# Altium schematic sheet ALLPRINT-CAPBOARD-677512-MCU.SchDoc
size A3; Organization: Altium Limited; Address1: 3 Minna Close; Address2: Belrose; Address3: NSW 2085; Address4: Australia; DocumentNumber: 3; SheetNumber: 2; SheetTotal: 11
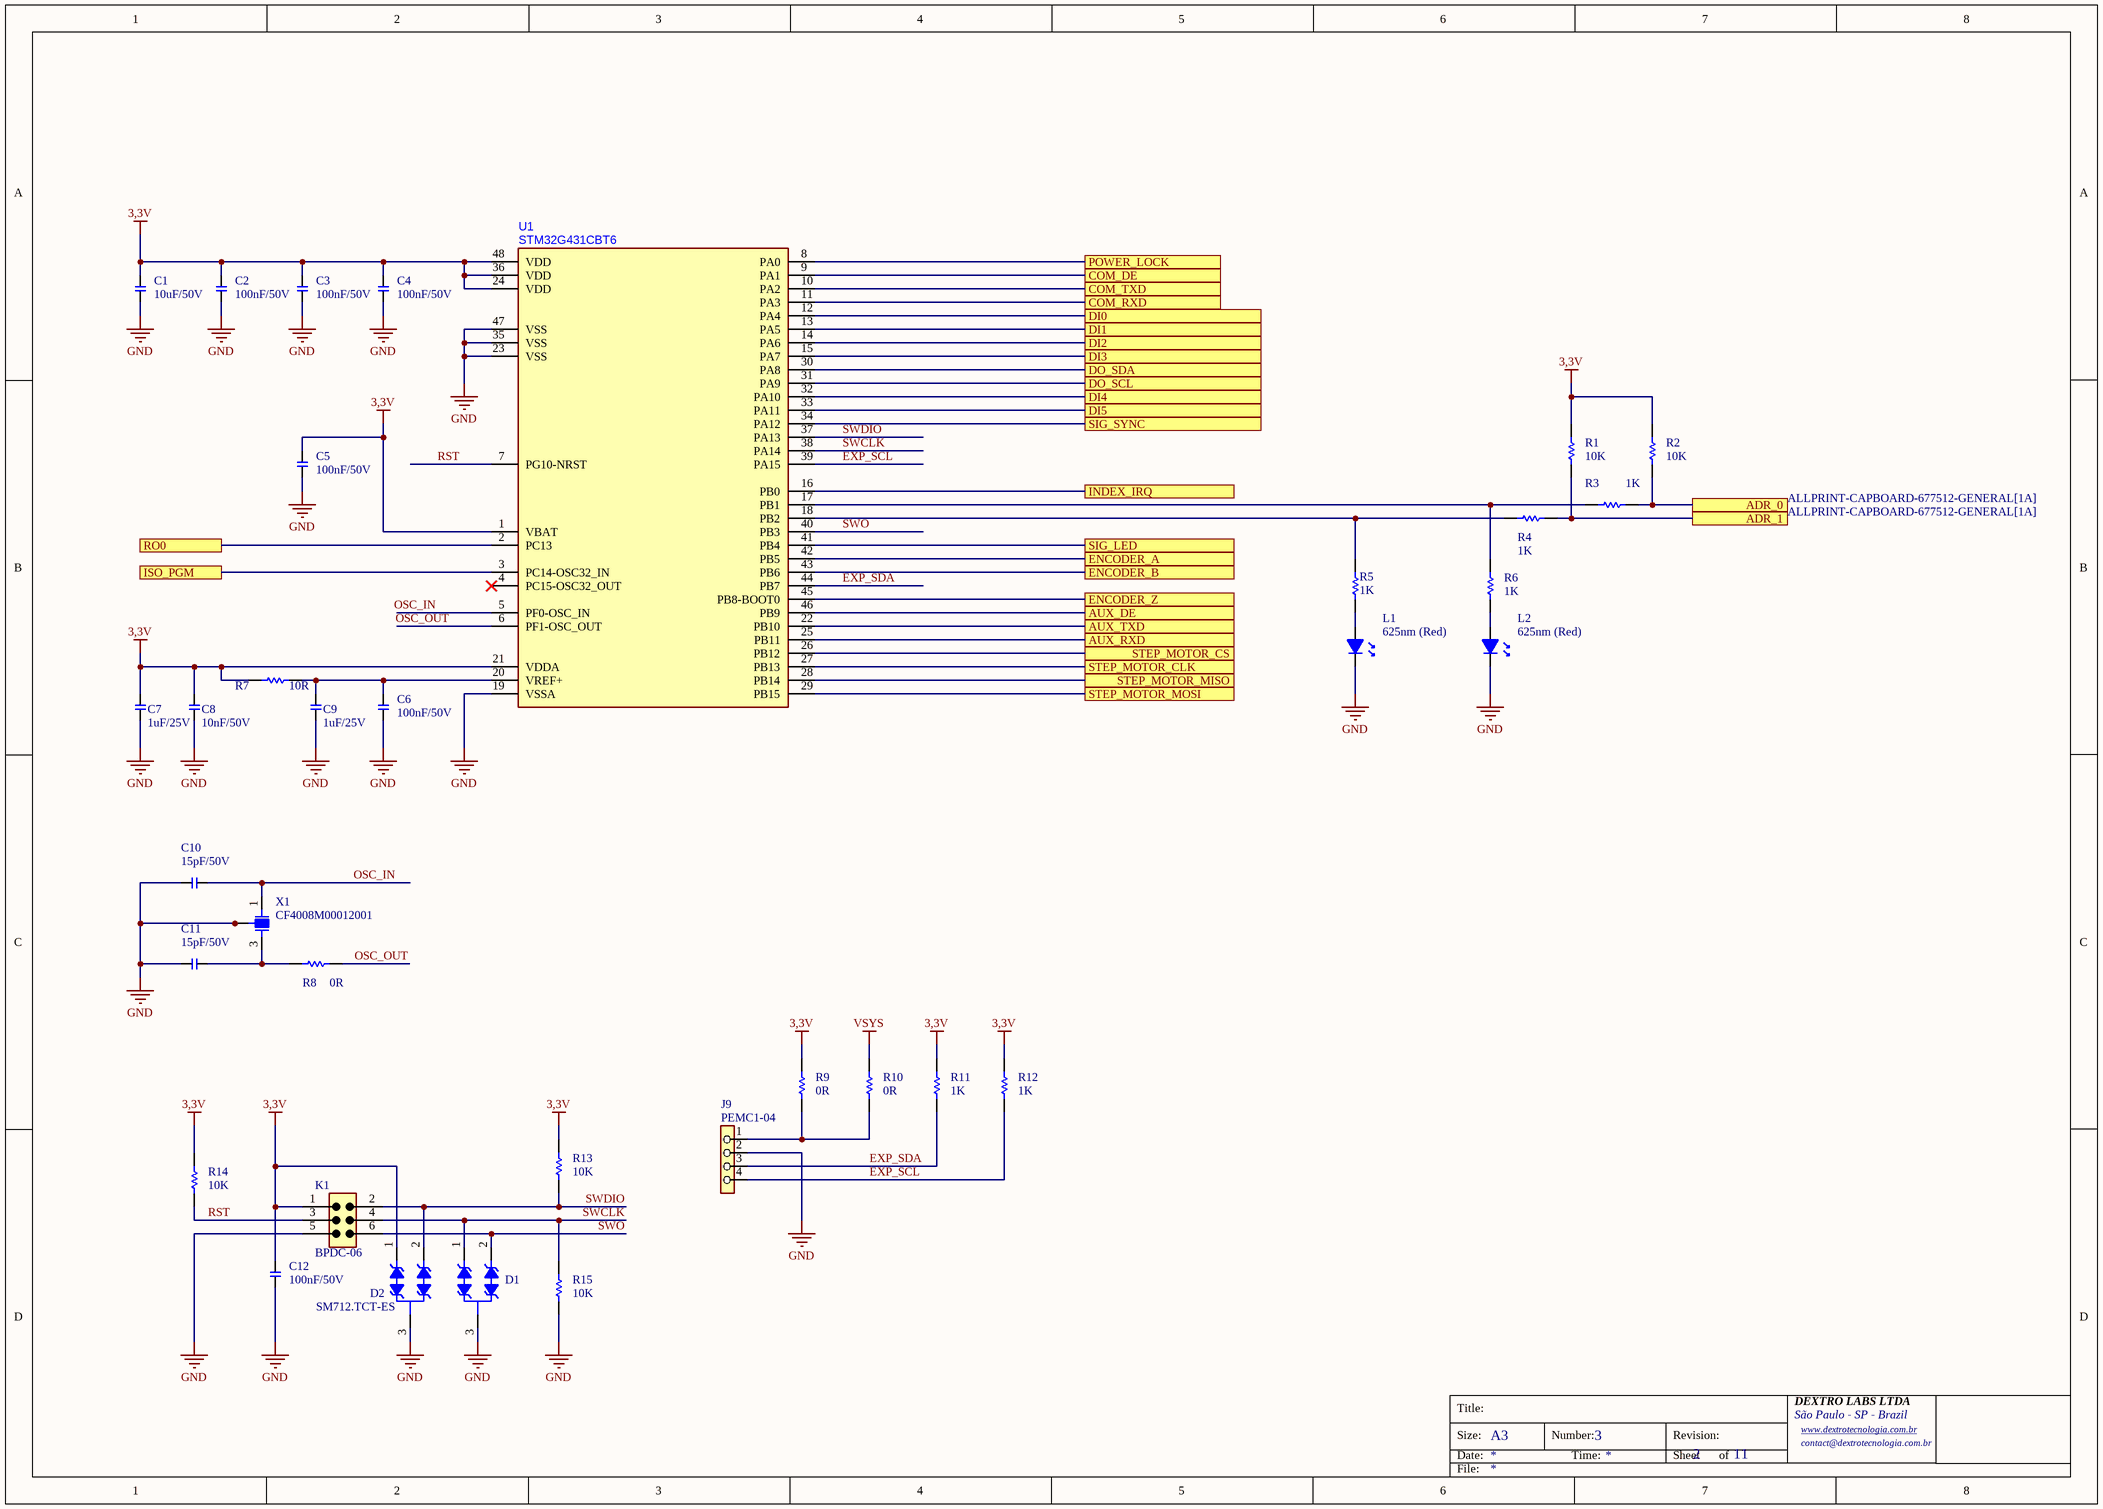
[diagram p0: ALLPRINT-CAPBOARD-677512-MCU.SchDoc]

## Parts
C1  10uF/50V  [CAP-0805]
C2  100nF/50V  [CAP-0603]
C3  100nF/50V  [CAP-0603]
C4  100nF/50V  [CAP-0603]
C5  100nF/50V  [CAP-0603]
C6  100nF/50V  [CAP-0603]
C7  1uF/25V  [CAP-0603]
C8  10nF/50V  [CAP-0603]
C9  1uF/25V  [CAP-0603]
C10  15pF/50V  [CAP-0603]
C11  15pF/50V  [CAP-0603]
C12  100nF/50V  [CAP-0603]
D1  SM712.TCT-ES  [SOT23-3]  (value not drawn)
D2  SM712.TCT-ES  [SOT23-3]
J9  PEMC1-04  [PEMC1-04]
K1  BPDC-06  [BPDC-06]
L1  Wavelength: 625nm (Red)  [LED-SMD-0603]  (hidden comment: YLED0603R)
L2  Wavelength: 625nm (Red)  [LED-SMD-0603]  (hidden comment: YLED0603R)
R1  10K  [RES-0603]
R2  10K  [RES-0603]
R3  1K  [RES-0603]
R4  1K  [RES-0603]
R5  1K  [RES-0603]
R6  1K  [RES-0603]
R7  10R  [RES-0603]
R8  0R  [RES-0603]
R9  0R  [RES-0805]
R10  0R  [RES-0805]
R11  1K  [RES-0603]
R12  1K  [RES-0603]
R13  10K  [RES-0603]
R14  10K  [RES-0603]
R15  10K  [RES-0603]
U1  STM32G431CBT6  [LQFP-48_L7.0-W7.0-P0.50-LS9.0-BL]
X1  CF4008M00012001  [TAXM8M4RDBCCT2T]

## Ports
ADR_0 (see ALLPRINT-CAPBOARD-677512-GENERAL[1A]), ADR_1 (see ALLPRINT-CAPBOARD-677512-GENERAL[1A]), AUX_DE (see ALLPRINT-CAPBOARD-677512-GENERAL[2B], ALLPRINT-CAPBOARD-677512-HEAD-BOARD-COMM[3C]), AUX_RXD (see ALLPRINT-CAPBOARD-677512-GENERAL[2B], ALLPRINT-CAPBOARD-677512-HEAD-BOARD-COMM[3C]), AUX_TXD (see ALLPRINT-CAPBOARD-677512-GENERAL[2B], ALLPRINT-CAPBOARD-677512-HEAD-BOARD-COMM[3C]), COM_DE (see ALLPRINT-CAPBOARD-677512-GENERAL[2B], ALLPRINT-CAPBOARD-677512-HEAD-BOARD-COMM[3B]), COM_RXD (see ALLPRINT-CAPBOARD-677512-GENERAL[2B], ALLPRINT-CAPBOARD-677512-HEAD-BOARD-COMM[3B]), COM_TXD (see ALLPRINT-CAPBOARD-677512-GENERAL[2B], ALLPRINT-CAPBOARD-677512-HEAD-BOARD-COMM[3B]), DI0 (see ALLPRINT-CAPBOARD-677512-GENERAL[2B], ALLPRINT-CAPBOARD-677512-SIGNAL-INPUTS[6A]), DI1 (see ALLPRINT-CAPBOARD-677512-GENERAL[2B], ALLPRINT-CAPBOARD-677512-SIGNAL-INPUTS[6B]), DI2 (see ALLPRINT-CAPBOARD-677512-GENERAL[2B], ALLPRINT-CAPBOARD-677512-SIGNAL-INPUTS[6B]), DI3 (see ALLPRINT-CAPBOARD-677512-GENERAL[2B], ALLPRINT-CAPBOARD-677512-SIGNAL-INPUTS[6C]), DI4 (see ALLPRINT-CAPBOARD-677512-GENERAL[2B], ALLPRINT-CAPBOARD-677512-SIGNAL-INPUTS[6C]), DI5 (see ALLPRINT-CAPBOARD-677512-GENERAL[2B], ALLPRINT-CAPBOARD-677512-SIGNAL-INPUTS[6D]), DO_SCL (see ALLPRINT-CAPBOARD-677512-GENERAL[2B], ALLPRINT-CAPBOARD-677512-DIGITAL-OUTPUTS[1B]), DO_SDA (see ALLPRINT-CAPBOARD-677512-GENERAL[2A], ALLPRINT-CAPBOARD-677512-DIGITAL-OUTPUTS[1B]), ENCODER_A (see ALLPRINT-CAPBOARD-677512-GENERAL[2C], ALLPRINT-CAPBOARD-677512-ENCODER-INPUT[6B]), ENCODER_B (see ALLPRINT-CAPBOARD-677512-GENERAL[2C], ALLPRINT-CAPBOARD-677512-ENCODER-INPUT[6B]), ENCODER_Z (see ALLPRINT-CAPBOARD-677512-GENERAL[2C], ALLPRINT-CAPBOARD-677512-ENCODER-INPUT[6C]), INDEX_IRQ (see ALLPRINT-CAPBOARD-677512-GENERAL[2A], ALLPRINT-CAPBOARD-677512-INDEX-INPUTS[7B]), ISO_PGM (see ALLPRINT-CAPBOARD-677512-GENERAL[2C], ALLPRINT-CAPBOARD-677512-ISO-PGM[3B]), POWER_LOCK (see ALLPRINT-CAPBOARD-677512-GENERAL[2C], ALLPRINT-CAPBOARD-677512-POWER[2D]), RO0 (see ALLPRINT-CAPBOARD-677512-GENERAL[2A], ALLPRINT-CAPBOARD-677512-SIGNAL-OUTPUTS[1D]), SIG_LED (see ALLPRINT-CAPBOARD-677512-GENERAL[2A], ALLPRINT-CAPBOARD-677512-SIGNAL-OUTPUTS[2B]), SIG_SYNC (see ALLPRINT-CAPBOARD-677512-GENERAL[2A], ALLPRINT-CAPBOARD-677512-SIGNAL-OUTPUTS[2A]), STEP_MOTOR_CLK (see ALLPRINT-CAPBOARD-677512-GENERAL[2D], ALLPRINT-CAPBOARD-677512-STEP-MOTOR-DRIVER[1A]), STEP_MOTOR_CS (see ALLPRINT-CAPBOARD-677512-GENERAL[2D], ALLPRINT-CAPBOARD-677512-STEP-MOTOR-DRIVER[1A]), STEP_MOTOR_MISO (see ALLPRINT-CAPBOARD-677512-GENERAL[2D], ALLPRINT-CAPBOARD-677512-STEP-MOTOR-DRIVER[1A]), STEP_MOTOR_MOSI (see ALLPRINT-CAPBOARD-677512-GENERAL[2D], ALLPRINT-CAPBOARD-677512-STEP-MOTOR-DRIVER[1A])

## Nets
3,3V: C1.2 C2.2 C3.2 C4.2 C5.2 C7.2 C8.2 C12.2 D2.1(A1) K1.1 R1.2 R2.2 R7.1 R9.2 R11.2 R12.2 R13.2 R14.2 U1.1(VBAT) U1.21(VDDA) U1.24(VDD) U1.36(VDD) U1.48(VDD)
GND: C1.1 C2.1 C3.1 C4.1 C5.1 C6.1 C7.1 C8.1 C9.1 C10.1 C11.1 C12.1 D1.3(K) D2.3(K) J9.2 K1.5 L1.1(K) L2.1(K) R15.1 U1.19(VSSA) U1.23(VSS) U1.35(VSS) U1.47(VSS) X1.2 X1.4
VSYS: R10.2
ADR_0: R2.1 R3.2 ; port ADR_0
ADR_1: R1.1 R4.2 ; port ADR_1
AUX_DE: U1.46(PB9) ; port AUX_DE
AUX_RXD: U1.25(PB11) ; port AUX_RXD
AUX_TXD: U1.22(PB10) ; port AUX_TXD
COM_DE: U1.9(PA1) ; port COM_DE
COM_RXD: U1.11(PA3) ; port COM_RXD
COM_TXD: U1.10(PA2) ; port COM_TXD
DI0: U1.12(PA4) ; port DI0
DI1: U1.13(PA5) ; port DI1
DI2: U1.14(PA6) ; port DI2
DI3: U1.15(PA7) ; port DI3
DI4: U1.32(PA10) ; port DI4
DI5: U1.33(PA11) ; port DI5
DO_SCL: U1.31(PA9) ; port DO_SCL
DO_SDA: U1.30(PA8) ; port DO_SDA
ENCODER_A: U1.42(PB5) ; port ENCODER_A
ENCODER_B: U1.43(PB6) ; port ENCODER_B
ENCODER_Z: U1.45(PB8-BOOT0) ; port ENCODER_Z
EXP_SCL: J9.4 R12.1 U1.39(PA15)
EXP_SDA: J9.3 R11.1 U1.44(PB7)
INDEX_IRQ: U1.16(PB0) ; port INDEX_IRQ
ISO_PGM: U1.3(PC14-OSC32_IN) ; port ISO_PGM
OSC_IN: C10.2 U1.5(PF0-OSC_IN) X1.1
OSC_OUT: R8.2 U1.6(PF1-OSC_OUT)
POWER_LOCK: U1.8(PA0) ; port POWER_LOCK
RO0: U1.2(PC13) ; port RO0
RST: K1.3 R14.1 U1.7(PG10-NRST)
SIG_LED: U1.41(PB4) ; port SIG_LED
SIG_SYNC: U1.34(PA12) ; port SIG_SYNC
STEP_MOTOR_CLK: U1.27(PB13) ; port STEP_MOTOR_CLK
STEP_MOTOR_CS: U1.26(PB12) ; port STEP_MOTOR_CS
STEP_MOTOR_MISO: U1.28(PB14) ; port STEP_MOTOR_MISO
STEP_MOTOR_MOSI: U1.29(PB15) ; port STEP_MOTOR_MOSI
SWCLK: D1.1(A1) K1.4 R15.2 U1.38(PA14)
SWDIO: D2.2(A2) K1.2 R13.1 U1.37(PA13)
SWO: D1.2(A2) K1.6 U1.40(PB3)
NetC6_2: C6.2 C9.2 R7.2 U1.20(VREF+)
NetC11_2: C11.2 R8.1 X1.3
NetJ9_1: J9.1 R9.1 R10.1
NetL1_2: L1.2(A) R5.2
NetL2_2: L2.2(A) R6.1
NetR3_1: R3.1 R6.2 U1.17(PB1)
NetR4_1: R4.1 R5.1 U1.18(PB2)

Not connected (* = marked no-connect by the designer): U1 4(PC15-OSC32_OUT)*

## Notes on the sheet
- Title:
- Size:
- Date:
- A3
- Number:
- Time:
- Revision:
- Sheet
- of
- DEXTRO LABS LTDA
- São Paulo - SP - Brazil
- www.dextrotecnologia.com.br <http://www.dextrotecnologia.com.br>
- contact@dextrotecnologia.com.br
- File:

## Library data of the parts
C1 = CAP-10uF/50V-0805-X5R-MLCC: 50V 10uF X5R ±10% 1206 Multilayer Ceramic Capacitors MLCC - SMD/SMT ROHS; LCSC: C13585
C2-C6 C12 = CAP-100nF/50V-0603-X7R-MLCC: 50V 100nF X7R ±10% 0603 Multilayer Ceramic Capacitors MLCC - SMD/SMT ROHS; LCSC: C14663
C7 C9 = CAP-1uF/25V-0603-X7R-MLCC: 25V 1uF X7R ±10% 0603 Multilayer Ceramic Capacitors MLCC - SMD/SMT ROHS; LCSC: C29936
C8 = CAP-10nF/50V-0603-X7R-MLCC: 50V 10nF X7R ±10% 0603 Multilayer Ceramic Capacitors MLCC - SMD/SMT ROHS; LCSC: C1589
C10 C11 = CAP-15pF/50V-0603-NP0-MLCC: 50V 15pF NP0 ±5% 0603 Ceramic Capacitors RoHS; LCSC: C107037
D1 D2 = SM712.TCT-ES: 400W@8/20us Bidirectional SOT-23 ESD and Surge Protection (TVS/ESD) ROHS; LCSC: C22363671
J9 = PEMC1-04: CONECTOR PASSO 2,5mm / 250VCA / 3A / 10mOHMS
K1 = BPDC-06: BARRA DE PINOS DUPLA 2,54mm 6 VIAS 180º
L1 L2 = D-LED-SMD-PKG@0603-RED: 25mA 120mcd 620nm~625nm Red 1.8V~2.4V 0603 LED Indication - Discrete RoHS; Part Number: YLED0603R; LCSC: C19171390
R1 R2 R13-R15 = RES-10K-1%-100mW-0603: 100mW Thick Film Resistor 75V ±100ppm/℃ ±1% 10kΩ 0603 Chip Resistor - Surface Mount ROHS; LCSC: C98220
R3-R6 R11 R12 = RES-1K-1%-100mW-0603: 100mW Thick Film Resistor 75V ±100ppm/℃ ±1% 1kΩ 0603 Chip Resistor - Surface Mount ROHS; LCSC: C22548
R7 = RES-10R-1%-100mW-0603: 100mW Thick Film Resistor 75V ±1% ±400ppm/℃ 10Ω 0603 Chip Resistor - Surface Mount ROHS; LCSC: C22859
R8 = RES-0R-1%-100mW-0603: 100mW 0Ω 75V Thick Film Resistor ±5% 0603 Chip Resistor - Surface Mount RoHS; LCSC: C95177
R9 R10 = RES-0R-1%-125mW-0805: 100mW Thick Film Resistor 75V ±100ppm/℃ ±1% 0R Chip Resistor - Surface Mount ROHS; LCSC: C17477
U1 = STM32G431CBT6: Manufacturer: ST(意法半导体); Add into BOM: yes; CPU Core: ARM Cortex-M Series; CPU Maximum Speed: 170MHz; Program Storage Size: 128KB; Program Memory Type: FLASH; Number of I/O: 38; ADC (Bit): 12bit; Voltage - Supply: 1.71V~3.6V; Symbol: STM32G431CBT6; Device: STM32G431CBT6; Supplier Part: C529355; Manufacturer Part: STM32G431CBT6; Supplier Footprint: LQFP-48(7x7); JLCPCB Part Class: Extended Part; Datasheet: https://item.szlcsc.com/datasheet/STM32G431CBT6/549633.html; Supplier: LCSC; Convert to PCB: yes; DAC (Bit): 12bit; Applications: -; LCSC: C529355
X1 = XTAL-8MHZ-3225-SMD: Crystal Oscillator 12pF SMD3225-4P Crystals RoHS; LCSC: C7294546